# Altium project AdcDacBoard.PrjPcb
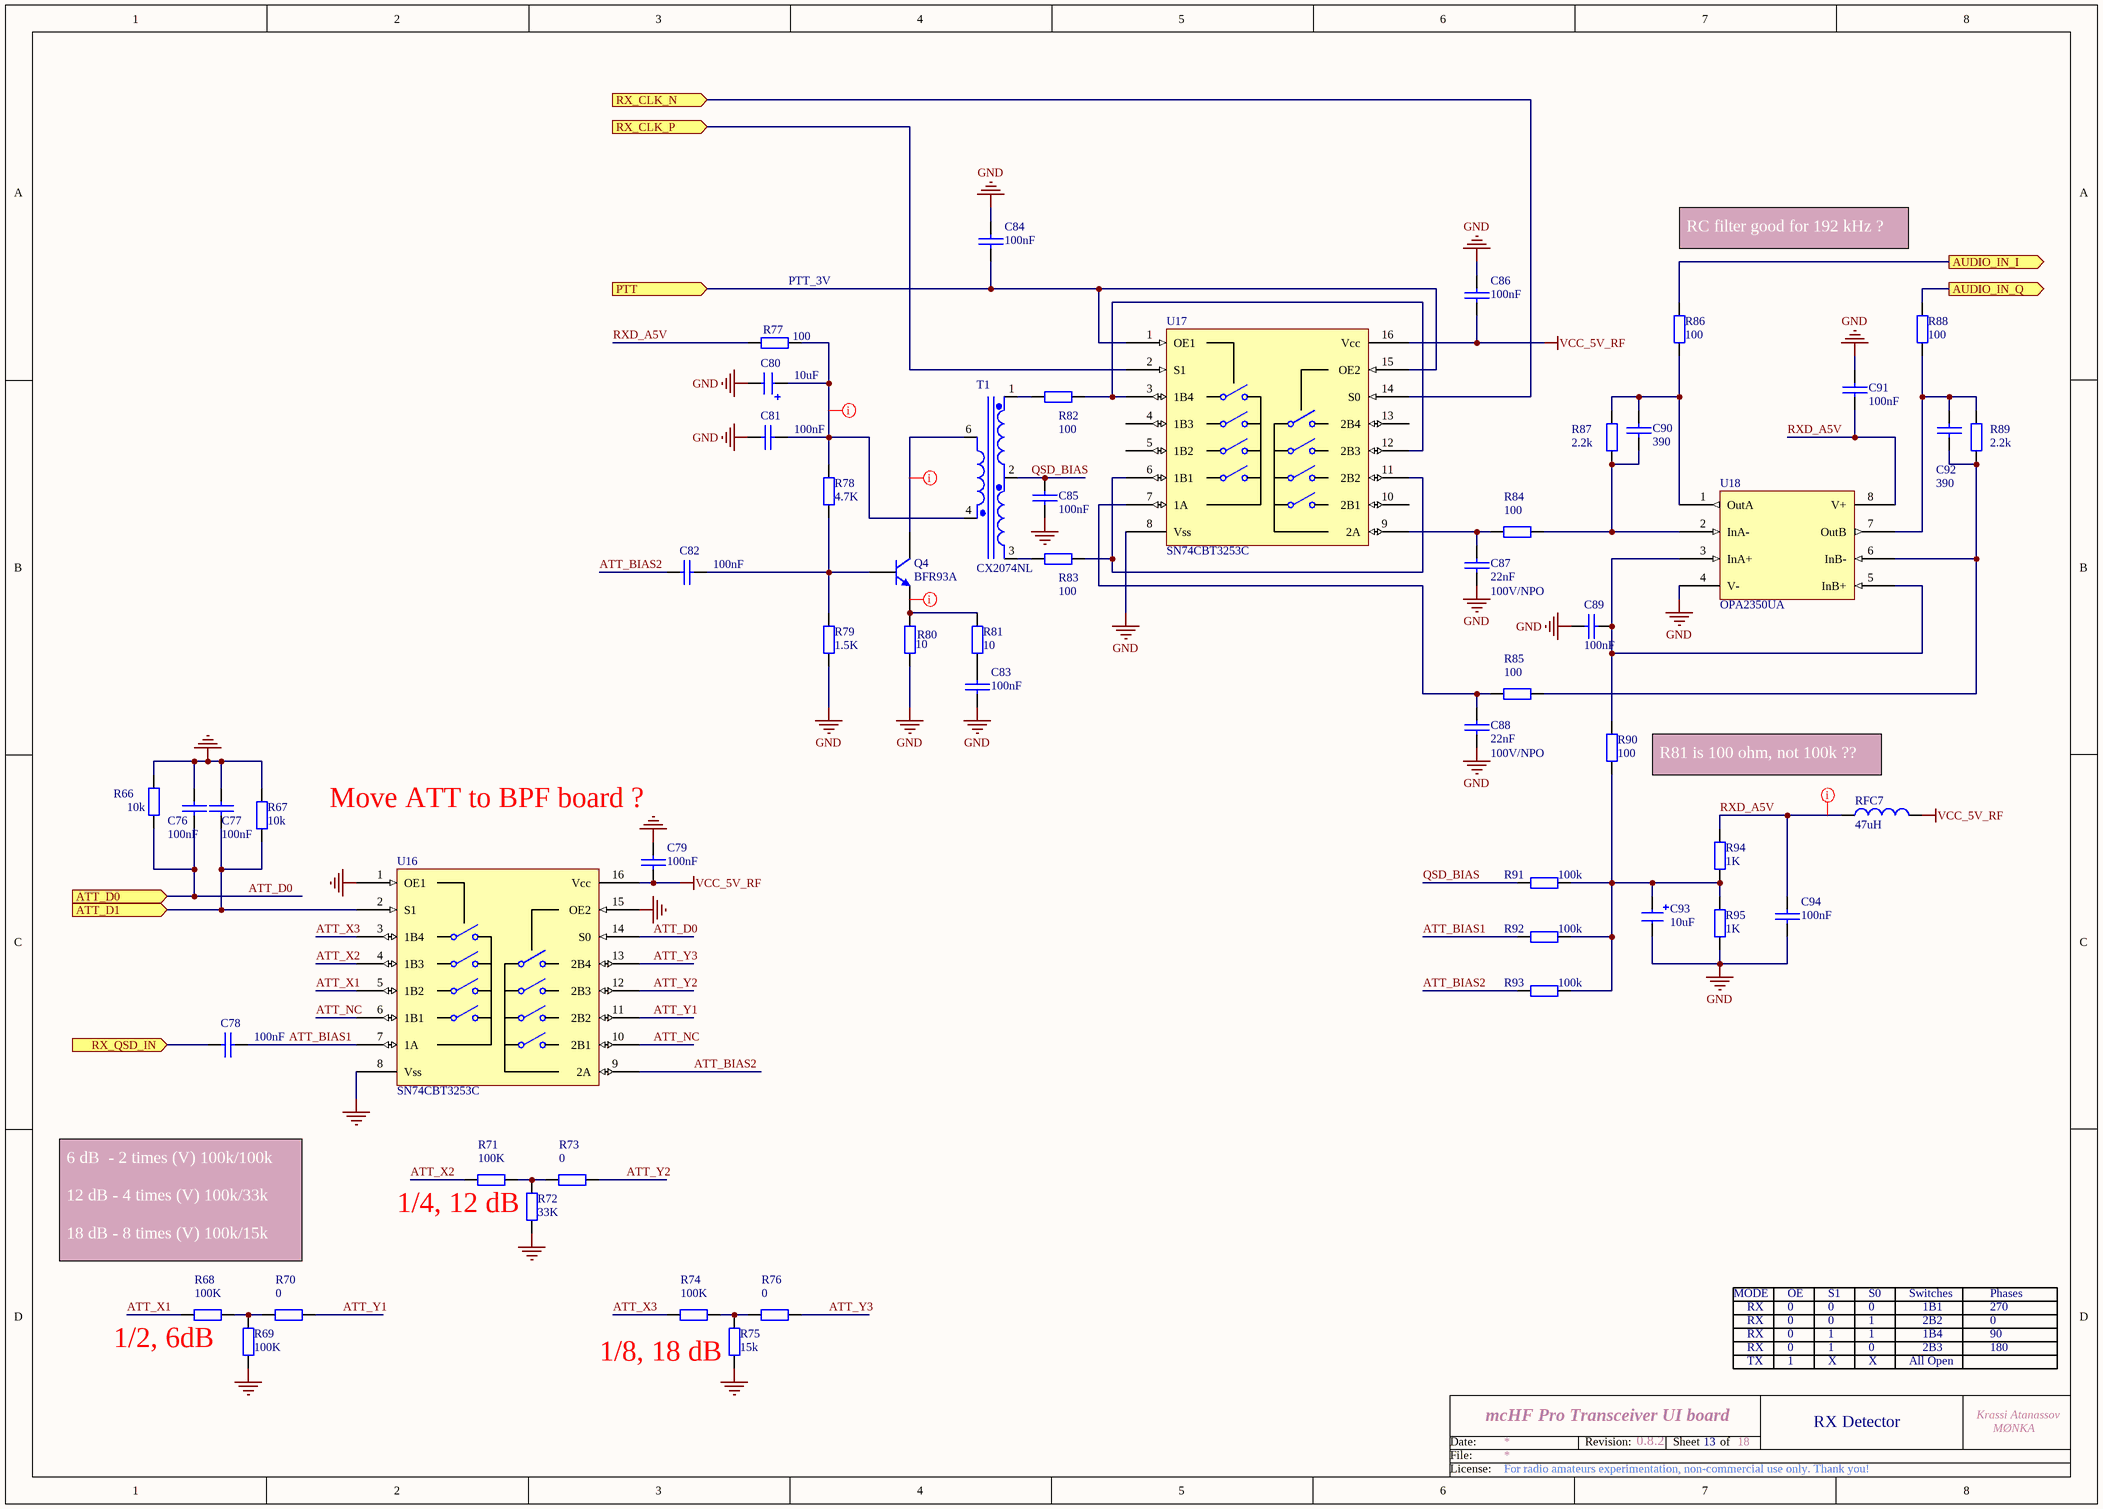
[diagram p0: adc_dac_rxd.SchDoc]
2 sheets, 67 parts. Net scope: flat (ports and power ports of the same name join across sheets).
Sheets:
  adc_dac_rxd.SchDoc
  adc_dac_conn.SchDoc

## Sheet adc_dac_rxd.SchDoc: mcHF Pro Transceiver UI board
size A3; Author: Krassi Atanassov; CompanyName: MØNKA; Engineer: For radio amateurs experimentation, non-commercial use only. Thank you!; Revision: 0.8.2; SheetTotal: 18

### Parts
C76  100nF  [0805]
C77  100nF  [0805]
C78  100nF  [0805]
C79  100nF  [0805]
C80  10uF  [1206_Elec_Cap]
C81  100nF  [0805]
C82  100nF  [0805]
C83  100nF  [0805]
C84  100nF  [0805]
C85  100nF  [0805]
C86  100nF  [0805]
C87  22nF  Voltage: 100V/NPO  [CAP_B]
C88  22nF  Voltage: 100V/NPO  [CAP_B]
C89  100nF  [0805]
C90  390  [0805]
C91  100nF  [0805]
C92  390  [0805]
C93  10uF  [1206_Elec_Cap]
C94  100nF  [0805]
Q4  BFR93A  [SOT-23]
R66  10k  [0805]
R67  10k  [0805]
R68  100K  [0805]  (no BOM)
R69  100K  [0805]  (no BOM)
R70  0  [0805]  (no BOM)
R71  100K  [0805]  (no BOM)
R72  33K  [0805]  (no BOM)
R73  0  [0805]  (no BOM)
R74  100K  [0805]  (no BOM)
R75  15k  [0805]  (no BOM)
R76  0  [0805]  (no BOM)
R77  100  [0805]
R78  4.7K  [0805]
R79  1.5K  [0805]
R80  10  [0805]
R81  10  [0805]
R82  100  [0805]
R83  100  [0805]
R84  100  [0805]
R85  100  [0805]
R86  100  [0805]
R87  2.2k  [0805]
R88  100  [0805]
R89  2.2k  [0805]
R90  100  [0805]
R91  100k  [0805]
R92  100k  [0805]
R93  100k  [0805]
R94  1K  [0805]
R95  1K  [0805]
RFC7  47uH  [0805]
T1  CX2074NL  [SOP5_NEW1]
U16  SN74CBT3253C  [SO-16-Pro]
U17  SN74CBT3253C  [SO-16-Pro]
U18  OPA2350UA  [SO-8]

### Ports
ATT_D0 (in), ATT_D1 (in), AUDIO_IN_I (out), AUDIO_IN_Q (out), PTT (in), RX_CLK_N (in), RX_CLK_P (in), RX_QSD_IN (in)

### Nets
GND: C76.2 C77.2 C79.2 C80.2 C81.2 C83.1 C84.2 C85.2 C86.2 C87.2 C88.2 C89.2 C91.1 C93.2 C94.1 R66.1 R67.1 R69.1 R72.1 R75.1 R79.2 R80.1 R95.1 U16.1(OE1) U16.8(Vss) U16.15(OE2) U17.8(Vss) U18.4(V-)
VCC_5V_RF: C79.1 C86.1 RFC7.2 U16.16(Vcc) U17.16(Vcc)
ATT_BIAS1: C78.1 R92.1 U16.7(1A)
ATT_BIAS2: C82.2 R93.1 U16.9(2A)
ATT_D0: C76.1 R66.2 U16.14(S0) ; port ATT_D0
ATT_NC: U16.6(1B1) U16.10(2B1)
ATT_X1: R68.1 U16.5(1B2)
ATT_X2: R71.1 U16.4(1B3)
ATT_X3: R74.1 U16.3(1B4)
ATT_Y1: R70.2 U16.11(2B2)
ATT_Y2: R73.2 U16.12(2B3)
ATT_Y3: R76.2 U16.13(2B4)
QSD_BIAS: C85.1 R91.2 T1.2(SecCmn)
RXD_A5V: C91.2 C94.2 R77.1 R94.2 RFC7.1 U18.8(V+)
NetC77_1: C77.1 R67.2 U16.2(S1) ; port ATT_D1
NetC78_2: C78.2 ; port RX_QSD_IN
NetC80_1: C80.1 C81.1 R77.2 R78.1 T1.4(Pri-)
NetC82_1: C82.1 Q4.1(B) R78.2 R79.1
NetC83_2: C83.2 R81.1
NetC84_1: C84.1 U17.1(OE1) U17.15(OE2) ; port PTT
NetC87_1: C87.1 R84.1 U17.9(2A)
NetC88_1: C88.1 R85.1 U17.7(1A)
NetC89_1: C89.1 R90.2 U18.3(InA+) U18.5(InB+)
NetC90_1: C90.1 R84.2 R87.1 U18.2(InA-)
NetC90_2: C90.2 R86.1 R87.2 U18.1(OutA)
NetC92_1: C92.1 R85.2 R89.1 U18.6(InB-)
NetC92_2: C92.2 R88.1 R89.2 U18.7(OutB)
NetC93_1: C93.1 R90.1 R91.1 R92.2 R93.2 R94.1 R95.2
NetQ4_2: Q4.2(E) R80.2 R81.2
NetQ4_3: Q4.3(C) T1.6(Pri+)
NetR68_2: R68.2 R69.2 R70.1
NetR71_2: R71.2 R72.2 R73.1
NetR74_2: R74.2 R75.2 R76.1
NetR82_1: R82.1 T1.1(Sec0)
NetR82_2: R82.2 U17.3(1B4) U17.12(2B3)
NetR83_1: R83.1 T1.3(Sec180)
NetR83_2: R83.2 U17.6(1B1) U17.11(2B2)
NetR86_2: R86.2 ; port AUDIO_IN_I
NetR88_2: R88.2 ; port AUDIO_IN_Q
NetU17_2: U17.2(S1) ; port RX_CLK_P
NetU17_14: U17.14(S0) ; port RX_CLK_N

Not connected (* = marked no-connect by the designer): U17 4(1B3) 5(1B2) 10(2B1) 13(2B4)

### Layout directives
rule Width Constraint [Pref Width = 12mil    Min Width = 12mil    Max Width = 12mil]: (no net found under the mark), NetC80_1, NetQ4_3, RXD_A5V

### Notes on the sheet
- RC filter good for 192 kHz ?
- PTT_3V
- R81 is 100 ohm, not 100k ??
- (near C79) Move ATT to BPF board ?
- 6 dB  - 2 times (V) 100k/100k
  12 dB - 4 times (V) 100k/33k
  18 dB - 8 times (V) 100k/15k
- (near R72) 1/4, 12 dB
- MODE
- RX
- 0
- OE
- S1
- S0
- 1
- Switches
- 1B1
- 2B2
- Phases
- 270
- (near R68) 1/2, 6dB
- (near R75) 1/8, 18 dB
- TX
- X
- All Open
- 2B3
- 1B4
- 180
- 90
- 13
- RX Detector
- Date:
- File:
- Revision:
- Sheet
- of
- License:

### Library data of the parts
C76-C79 C81-C86 C89 C91 C94 = CAP: Capacitor; Order: FN 252-2090; QT Order: QCC-00154; Price: 0.068
C80 C93 = CAP-POL: Electrolitic capacitor; Order: FN 233-3009; QT Order: QCC-00166; Price: 0.204
C87 C88 = CAP: Capacitor; Order: FN 221-1120; Price: 0.84
C90 C92 = CAP: Capacitor; Order: FN 233-2701; QT Order: QCC-00125; Price: 0.078
Q4 = BFR93A: TRANSISTOR, RF, NPN, 12V, 0.035MA,SOT-23; Order: FN 108-1300; Price: 0.161
R66 R67 = RES: Resistor; Order: FN 146-9857; Price: 0.046
R68-R76 R92 R93 = RES: Resistor; QT Order: QCR-00373; Price: 0.021
R77 R82-R86 R88 R90 R91 = RES: Resistor; Order: FN 933-2375; QT Order: QCR-00301; Price: 0.027
R78 = RES: Resistor; Order: FN 200-8383; QT Order: QCR-00341; Price: 0.024
R79 = RES: Resistor; Order: FN 165-2940; QT Order: QCR-00329; Price: 0.036
R80 R81 = RES: Resistor; Order: FN 933-2421; QT Order: QCR-00279; Price: 0.013
R87 R89 = RES: Resistor; Order: FN 188-7289; QT Order: QCR-00333; Price: 0.046
R94 R95 = RES: Resistor; Order: FN 157-6459; QT Order: QCR-00579; Price: 0.061
RFC7 = TDK-NLV25T: INDUCTOR, SIGNAL LINE, 4.7UH, 1005; Order: FN 166-9895; Price: 0.166
T1 = CX2074NL: Wideband RF Transformer 1:4; Order: DK 553-1655-ND; Price: 2.01
U16 U17 = SN74CBT3253C: Dual 4:1 Demux/Analog Switch; Order: FN 175-0447; Price: 0.69
U18 = OPA2350UA: High Speed, Single Supply OpAmp; Order: FN 110-1542; Price: 4.67

## Sheet adc_dac_conn.SchDoc: mcHF Pro Transceiver UI board
size A3; Author: Krassi Atanassov; CompanyName: MØNKA; Engineer: For radio amateurs experimentation, non-commercial use only. Thank you!; Revision: 0.8.2; SheetTotal: 18
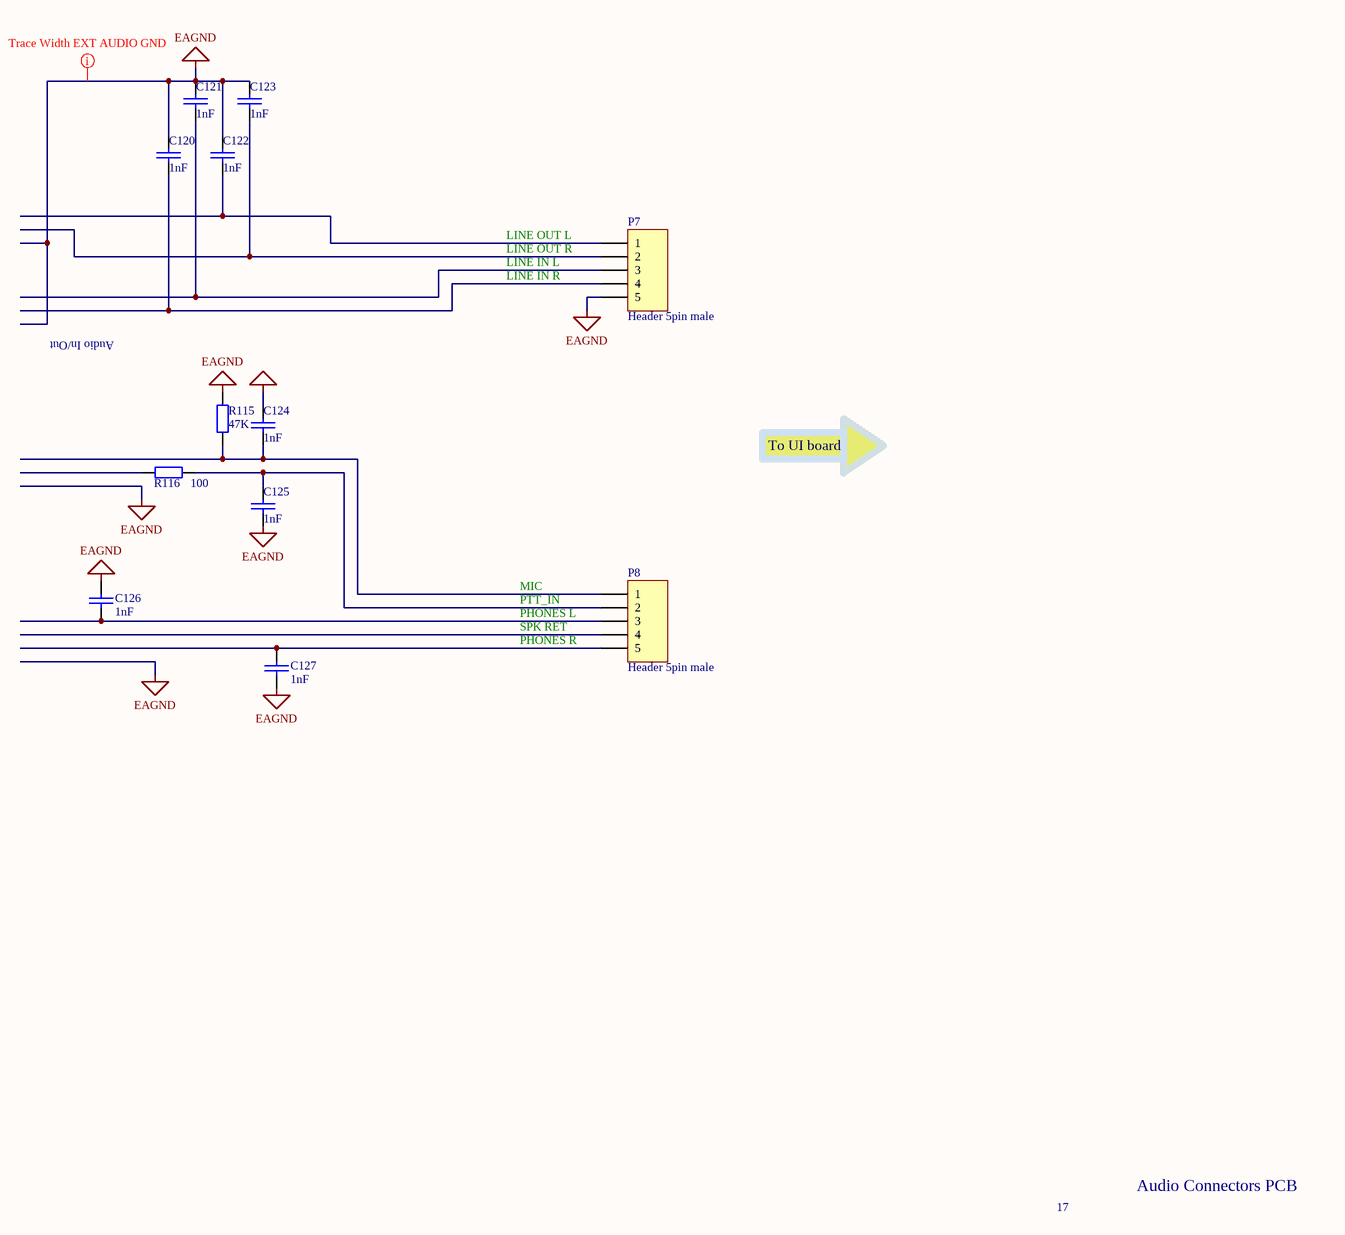
[diagram p1: adc_dac_conn.SchDoc]

### Parts
C120  1nF  [0805]
C121  1nF  [0805]
C122  1nF  [0805]
C123  1nF  [0805]
C124  1nF  [0805]
C125  1nF  [0805]
C126  1nF  [0805]
C127  1nF  [0805]
P7  Header 5pin male  [HDR1X5]
P8  Header 5pin male  [HDR1X5]
R115  47K  [0805]
R116  100  [0805]

### Nets
EAGND: C120.1 C121.1 C122.1 C123.1 C124.1 C125.2 C126.2 C127.1 P7.5 R115.2
NetC120_2: C120.2 P7.4
NetC121_2: C121.2 P7.3
NetC122_2: C122.2 P7.1
NetC123_2: C123.2 P7.2
NetC124_2: C124.2 P8.1 R115.1
NetC125_1: C125.1 P8.2 R116.2
NetC126_1: C126.1 P8.3
NetC127_2: C127.2 P8.5

Not connected (* = marked no-connect by the designer): P8 4; R116 1

### Layout directives
rule Width Constraint [Pref Width = 30mil    Min Width = 30mil    Max Width = 30mil]: EAGND

### Notes on the sheet
- LINE OUT L
- LINE OUT R
- LINE IN L
- LINE IN R
- Audio In/Out
- To UI board
- MIC
- PTT_IN
- PHONES L
- PHONES R
- SPK RET
- 17
- Audio Connectors PCB
- Date:
- File:
- Revision:
- Sheet
- of
- License:

### Library data of the parts
C120-C127 = CAP: Capacitor; Order: FN 185-6408; QT Order: QCC-00259; Price: 0.01
P7 P8 = Header 5: Header, 5-Pin
R115 = RES: Resistor; Order: FN 146-9929; QT Order: QCR-00365; Price: 0.021
R116 = RES: as R77 on sheet adc_dac_rxd; Price: 0.027